# Altium schematic sheet TOP_sheet.SchDoc
size A3; SheetNumber: 1; SheetTotal: 8
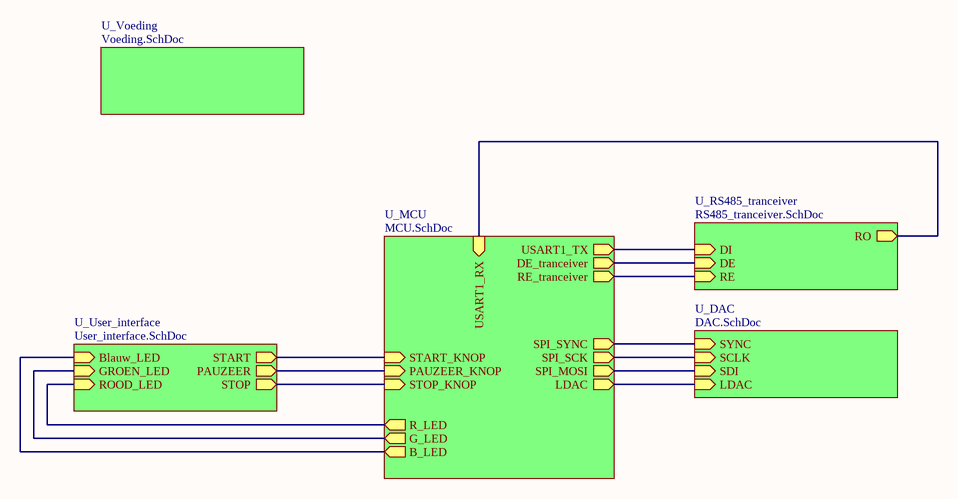
[diagram p0: TOP_sheet.SchDoc]

## Sub-sheets
U_DAC = DAC.SchDoc: SYNC (in), SCLK (in), SDI (in), LDAC (in)
U_MCU = MCU.SchDoc: USART1_TX (out), USART1_RX (in), RE_tranceiver (out), DE_tranceiver (out), SPI_SCK (out), SPI_MOSI (out), START_KNOP (in), PAUZEER_KNOP (in), STOP_KNOP (in), B_LED (out), G_LED (out), R_LED (out), LDAC (out), SPI_SYNC (out)
U_RS485_tranceiver = RS485_tranceiver.SchDoc: DE (in), RE (in), DI (in), RO (out)
U_User_interface = User_interface.SchDoc: Blauw_LED (in), GROEN_LED (in), ROOD_LED (in), START (out), PAUZEER (out), STOP (out)
U_Voeding = Voeding.SchDoc: no entries

## Nets
(unnamed): sheet U_DAC/SYNC, sheet U_MCU/SPI_SYNC
(unnamed): sheet U_DAC/SCLK, sheet U_MCU/SPI_SCK
(unnamed): sheet U_DAC/SDI, sheet U_MCU/SPI_MOSI
(unnamed): sheet U_DAC/LDAC, sheet U_MCU/LDAC
(unnamed): sheet U_MCU/USART1_TX, sheet U_RS485_tranceiver/DI
(unnamed): sheet U_MCU/USART1_RX, sheet U_RS485_tranceiver/RO
(unnamed): sheet U_MCU/RE_tranceiver, sheet U_RS485_tranceiver/RE
(unnamed): sheet U_MCU/DE_tranceiver, sheet U_RS485_tranceiver/DE
(unnamed): sheet U_MCU/START_KNOP, sheet U_User_interface/START
(unnamed): sheet U_MCU/PAUZEER_KNOP, sheet U_User_interface/PAUZEER
(unnamed): sheet U_MCU/STOP_KNOP, sheet U_User_interface/STOP
(unnamed): sheet U_MCU/B_LED, sheet U_User_interface/Blauw_LED
(unnamed): sheet U_MCU/G_LED, sheet U_User_interface/GROEN_LED
(unnamed): sheet U_MCU/R_LED, sheet U_User_interface/ROOD_LED